# EAGLE design sch (EAGLE 8.0.1)
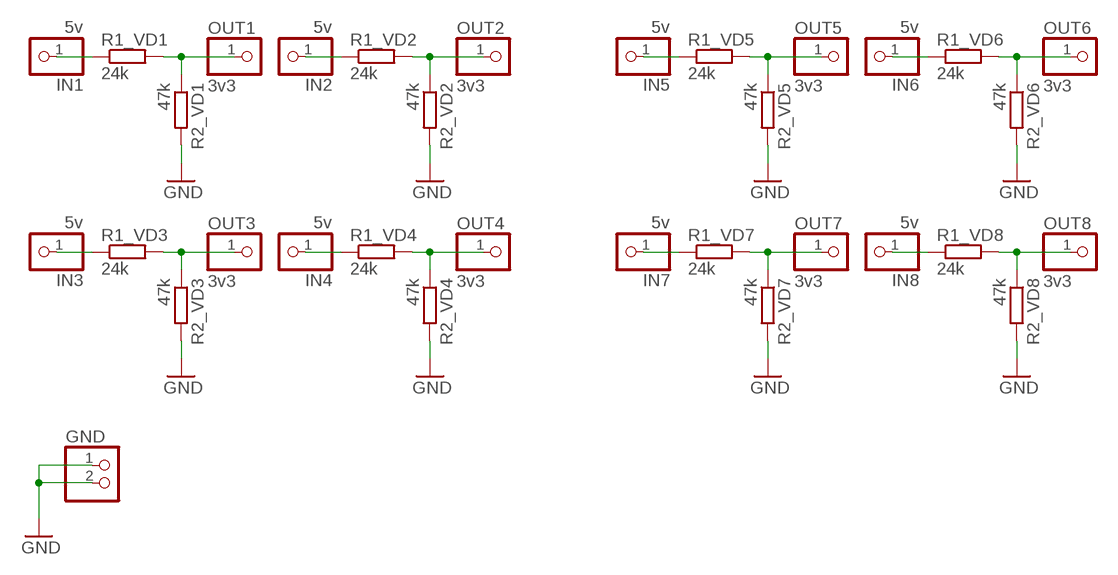
[diagram p0: schematic, sheet 1]

## Parts
GND  PINHD-1X2  [1X02]
IN1  5v  PINHD-1X1  [1X01]
IN2  5v  PINHD-1X1  [1X01]
IN3  5v  PINHD-1X1  [1X01]
IN4  5v  PINHD-1X1  [1X01]
IN5  5v  PINHD-1X1  [1X01]
IN6  5v  PINHD-1X1  [1X01]
IN7  5v  PINHD-1X1  [1X01]
IN8  5v  PINHD-1X1  [1X01]
OUT1  3v3  PINHD-1X1  [1X01]
OUT2  3v3  PINHD-1X1  [1X01]
OUT3  3v3  PINHD-1X1  [1X01]
OUT4  3v3  PINHD-1X1  [1X01]
OUT5  3v3  PINHD-1X1  [1X01]
OUT6  3v3  PINHD-1X1  [1X01]
OUT7  3v3  PINHD-1X1  [1X01]
OUT8  3v3  PINHD-1X1  [1X01]
R1_VD1  24k  R-EU_R1206  [R1206]
R1_VD2  24k  R-EU_R1206  [R1206]
R1_VD3  24k  R-EU_R1206  [R1206]
R1_VD4  24k  R-EU_R1206  [R1206]
R1_VD5  24k  R-EU_R1206  [R1206]
R1_VD6  24k  R-EU_R1206  [R1206]
R1_VD7  24k  R-EU_R1206  [R1206]
R1_VD8  24k  R-EU_R1206  [R1206]
R2_VD1  47k  R-EU_R1206  [R1206]
R2_VD2  47k  R-EU_R1206  [R1206]
R2_VD3  47k  R-EU_R1206  [R1206]
R2_VD4  47k  R-EU_R1206  [R1206]
R2_VD5  47k  R-EU_R1206  [R1206]
R2_VD6  47k  R-EU_R1206  [R1206]
R2_VD7  47k  R-EU_R1206  [R1206]
R2_VD8  47k  R-EU_R1206  [R1206]

## Nets
GND: GND.1 GND.2 R2_VD1.2 R2_VD2.2 R2_VD3.2 R2_VD4.2 R2_VD5.2 R2_VD6.2 R2_VD7.2 R2_VD8.2
N$1: OUT1.1 R1_VD1.2 R2_VD1.1
N$2: IN1.1 R1_VD1.1
N$3: OUT2.1 R1_VD2.2 R2_VD2.1
N$4: IN2.1 R1_VD2.1
N$5: OUT3.1 R1_VD3.2 R2_VD3.1
N$6: IN3.1 R1_VD3.1
N$7: OUT4.1 R1_VD4.2 R2_VD4.1
N$8: IN4.1 R1_VD4.1
N$9: OUT5.1 R1_VD5.2 R2_VD5.1
N$10: IN5.1 R1_VD5.1
N$11: OUT6.1 R1_VD6.2 R2_VD6.1
N$12: IN6.1 R1_VD6.1
N$13: OUT7.1 R1_VD7.2 R2_VD7.1
N$14: IN7.1 R1_VD7.1
N$15: OUT8.1 R1_VD8.2 R2_VD8.1
N$16: IN8.1 R1_VD8.1

## Library data of the parts
GND = pinhead:PINHD-1X2: PIN HEADER
IN1-IN8 OUT1-OUT8 = pinhead:PINHD-1X1: PIN HEADER
R1_VD1-R1_VD8 R2_VD1-R2_VD8 = rcl:R-EU_: RESISTOR, European symbol

## Board
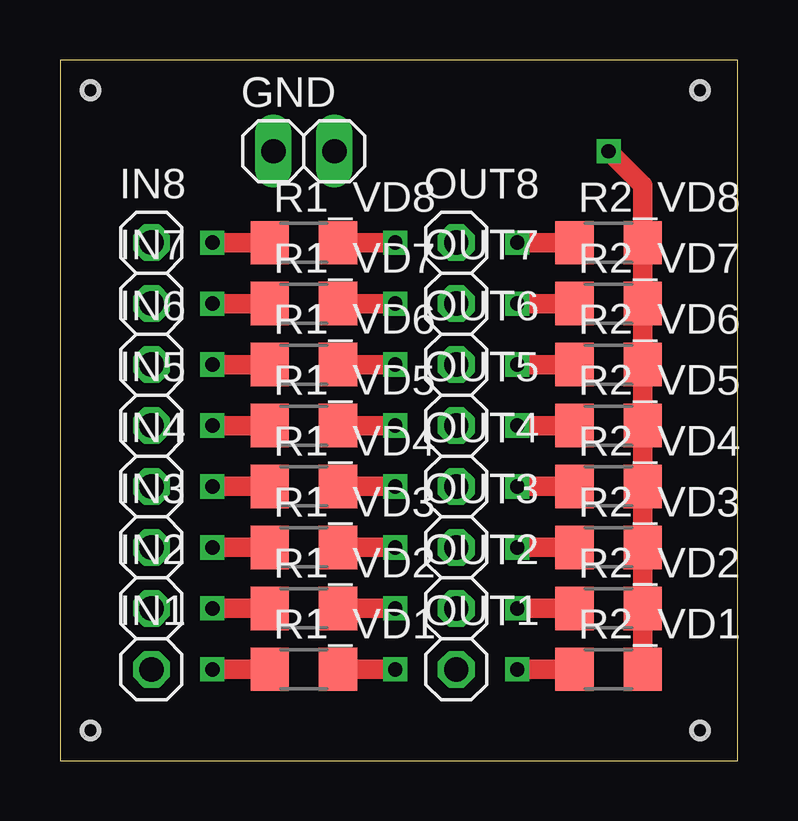
[diagram p1: board, top side]
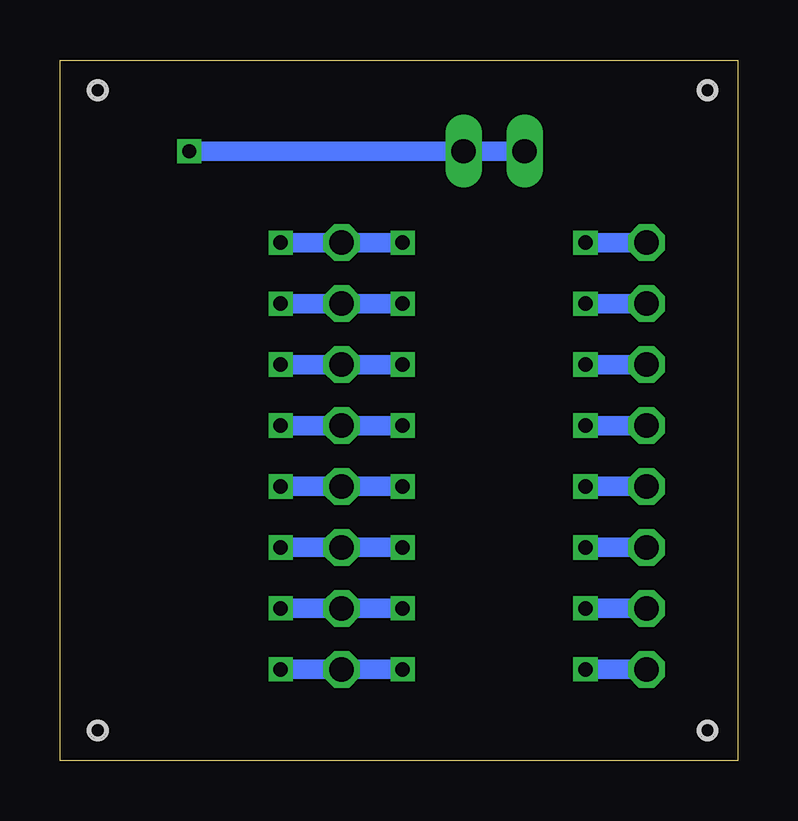
[diagram p2: board, bottom side, seen from below]

Size 28.25 x 29.2 mm. Coordinates in mm from the lower left corner, seen from the top.
Outline: 0,0 28.25,0 28.25,29.2 0,29.2 0,0
Copper layers (1*16): Top 0.035mm / dielectric 1.5mm / Bottom 0.035mm
Design rules "default": minimum track width 10mil, minimum drill 24mil, track to track 8mil, track to pad 8mil, pad to pad 8mil, via to via 8mil, smd to smd 8mil, copper to edge 40mil, drill to drill 8mil, minimum pad ring 10mil, minimum via ring 8mil, stop-mask expansion 4mil, vias tented up to drill 0mil, thermal gap 10mil
Holes 0.6 mm at 1.27,27.94 26.67,27.94 26.67,1.27 1.27,1.27
Holes 0.8 mm at 1.27,27.94 26.67,27.94 26.67,1.27 1.27,1.27

### Footprints (pad centres in the part's own frame; a part is rotated, then mirrored left to right if it is on the bottom)
1X02 = drill 1.016 long: 1 -1.27,0; 2 1.27,0
1X01 = drill 1.016 octagon: 1 0,0
R1206 = smd 1.6 x 1.803: 1 -1.422,0; 2 1.422,0

### Placement (x,y rotation side)
GND  10.16,25.4 0 top
IN1  3.81,3.81 0 top
IN2  3.81,6.35 0 top
IN3  3.81,8.89 0 top
IN4  3.81,11.43 0 top
IN5  3.81,13.97 0 top
IN6  3.81,16.51 0 top
IN7  3.81,19.05 0 top
IN8  3.81,21.59 0 top
OUT1  16.51,3.81 0 top
OUT2  16.51,6.35 0 top
OUT3  16.51,8.89 0 top
OUT4  16.51,11.43 0 top
OUT5  16.51,13.97 0 top
OUT6  16.51,16.51 0 top
OUT7  16.51,19.05 0 top
OUT8  16.51,21.59 0 top
R1_VD1  10.16,3.81 0 top
R1_VD2  10.16,6.35 0 top
R1_VD3  10.16,8.89 0 top
R1_VD4  10.16,11.43 0 top
R1_VD5  10.16,13.97 0 top
R1_VD6  10.16,16.51 0 top
R1_VD7  10.16,19.05 0 top
R1_VD8  10.16,21.59 0 top
R2_VD1  22.86,3.81 0 top
R2_VD2  22.86,6.35 0 top
R2_VD3  22.86,8.89 0 top
R2_VD4  22.86,11.43 0 top
R2_VD5  22.86,13.97 0 top
R2_VD6  22.86,16.51 0 top
R2_VD7  22.86,19.05 0 top
R2_VD8  22.86,21.59 0 top

### Tracks (layer width: path | path; a pad name or v marks a point on that pad's centre or on a via)
GND  (via drill 0.6)
  Top 0.813: R2_VD1.2 R2_VD2.2 R2_VD3.2 R2_VD4.2 R2_VD5.2 R2_VD6.2 R2_VD7.2 R2_VD8.2 24.28,23.98 v22.86,25.4
  Bottom 0.813: v22.86,25.4 GND.2 GND.1
N$1  (via drill 0.6)
  Top 0.813: R2_VD1.1 v19.05,3.81 | v13.97,3.81 R1_VD1.2
  Bottom 0.813: v19.05,3.81 OUT1.1 v13.97,3.81
N$2  (via drill 0.6)
  Top 0.813: v6.35,3.81 R1_VD1.1
  Bottom 0.813: IN1.1 v6.35,3.81
N$3  (via drill 0.6)
  Top 0.813: R1_VD2.2 v13.97,6.35 | v19.05,6.35 R2_VD2.1
  Bottom 0.813: v13.97,6.35 OUT2.1 v19.05,6.35
N$4  (via drill 0.6)
  Top 0.813: R1_VD2.1 v6.35,6.35
  Bottom 0.813: v6.35,6.35 IN2.1
N$5  (via drill 0.6)
  Top 0.813: R2_VD3.1 v19.05,8.89 | v13.97,8.89 R1_VD3.2
  Bottom 0.813: v19.05,8.89 OUT3.1 v13.97,8.89
N$6  (via drill 0.6)
  Top 0.813: v6.35,8.89 R1_VD3.1
  Bottom 0.813: IN3.1 v6.35,8.89
N$7  (via drill 0.6)
  Top 0.813: R1_VD4.2 v13.97,11.43 | v19.05,11.43 R2_VD4.1
  Bottom 0.813: v13.97,11.43 OUT4.1 v19.05,11.43
N$8  (via drill 0.6)
  Top 0.813: R1_VD4.1 v6.35,11.43
  Bottom 0.813: v6.35,11.43 IN4.1
N$9  (via drill 0.6)
  Top 0.813: R2_VD5.1 v19.05,13.97 | v13.97,13.97 R1_VD5.2
  Bottom 0.813: v19.05,13.97 OUT5.1 v13.97,13.97
N$10  (via drill 0.6)
  Top 0.813: v6.35,13.97 R1_VD5.1
  Bottom 0.813: IN5.1 v6.35,13.97
N$11  (via drill 0.6)
  Top 0.813: R1_VD6.2 v13.97,16.51 | v19.05,16.51 R2_VD6.1
  Bottom 0.813: v13.97,16.51 OUT6.1 v19.05,16.51
N$12  (via drill 0.6)
  Top 0.813: R1_VD6.1 v6.35,16.51
  Bottom 0.813: v6.35,16.51 IN6.1
N$13  (via drill 0.6)
  Top 0.813: R2_VD7.1 v19.05,19.05 | v13.97,19.05 R1_VD7.2
  Bottom 0.813: v19.05,19.05 OUT7.1 v13.97,19.05
N$14  (via drill 0.6)
  Top 0.813: v6.35,19.05 R1_VD7.1
  Bottom 0.813: IN7.1 v6.35,19.05
N$15  (via drill 0.6)
  Top 0.813: R1_VD8.2 v13.97,21.59 | v19.05,21.59 R2_VD8.1
  Bottom 0.813: v13.97,21.59 OUT8.1 v19.05,21.59
N$16  (via drill 0.6)
  Top 0.406: v6.35,21.59 R1_VD8.1
  Top 0.813: R1_VD8.1 v6.35,21.59
  Bottom 0.406: v6.35,21.59 IN8.1
  Bottom 0.813: IN8.1 v6.35,21.59